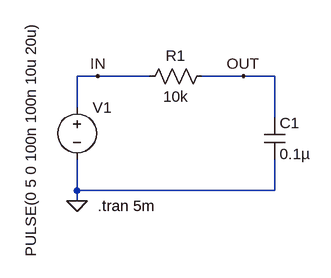
[diagram p0: schematic DAC.asc]
DAC.asc, the LTspice schematic file:
Version 4
SHEET 1 880 680
WIRE 48 128 16 128
WIRE 128 128 48 128
WIRE 272 128 208 128
WIRE 320 128 272 128
WIRE 16 176 16 128
WIRE 320 192 320 128
WIRE 16 304 16 256
WIRE 320 304 320 256
WIRE 320 304 16 304
WIRE 16 320 16 304
FLAG 16 320 0
FLAG 272 128 OUT
FLAG 48 128 IN
SYMBOL res 224 112 R90
WINDOW 0 0 56 VBottom 2
WINDOW 3 32 56 VTop 2
SYMATTR InstName R1
SYMATTR Value 10k
SYMBOL cap 304 192 R0
SYMATTR InstName C1
SYMATTR Value 0.1µ
SYMBOL voltage 16 160 R0
WINDOW 3 -71 247 VLeft 2
WINDOW 123 0 0 Left 0
WINDOW 39 0 0 Left 0
SYMATTR InstName V1
SYMATTR Value PULSE(0 5 0 100n 100n 10u 20u)
TEXT 48 328 Left 2 !.tran 5m

The netlist it stands for:
* DAC.asc
R1 OUT IN 10k
C1 OUT 0 0.1µ
V1 IN 0 PULSE(0 5 0 100n 100n 10u 20u)
.tran 5m
.backanno
.end